# EAGLE design AdelinoR1 (EAGLE 9.2.1)
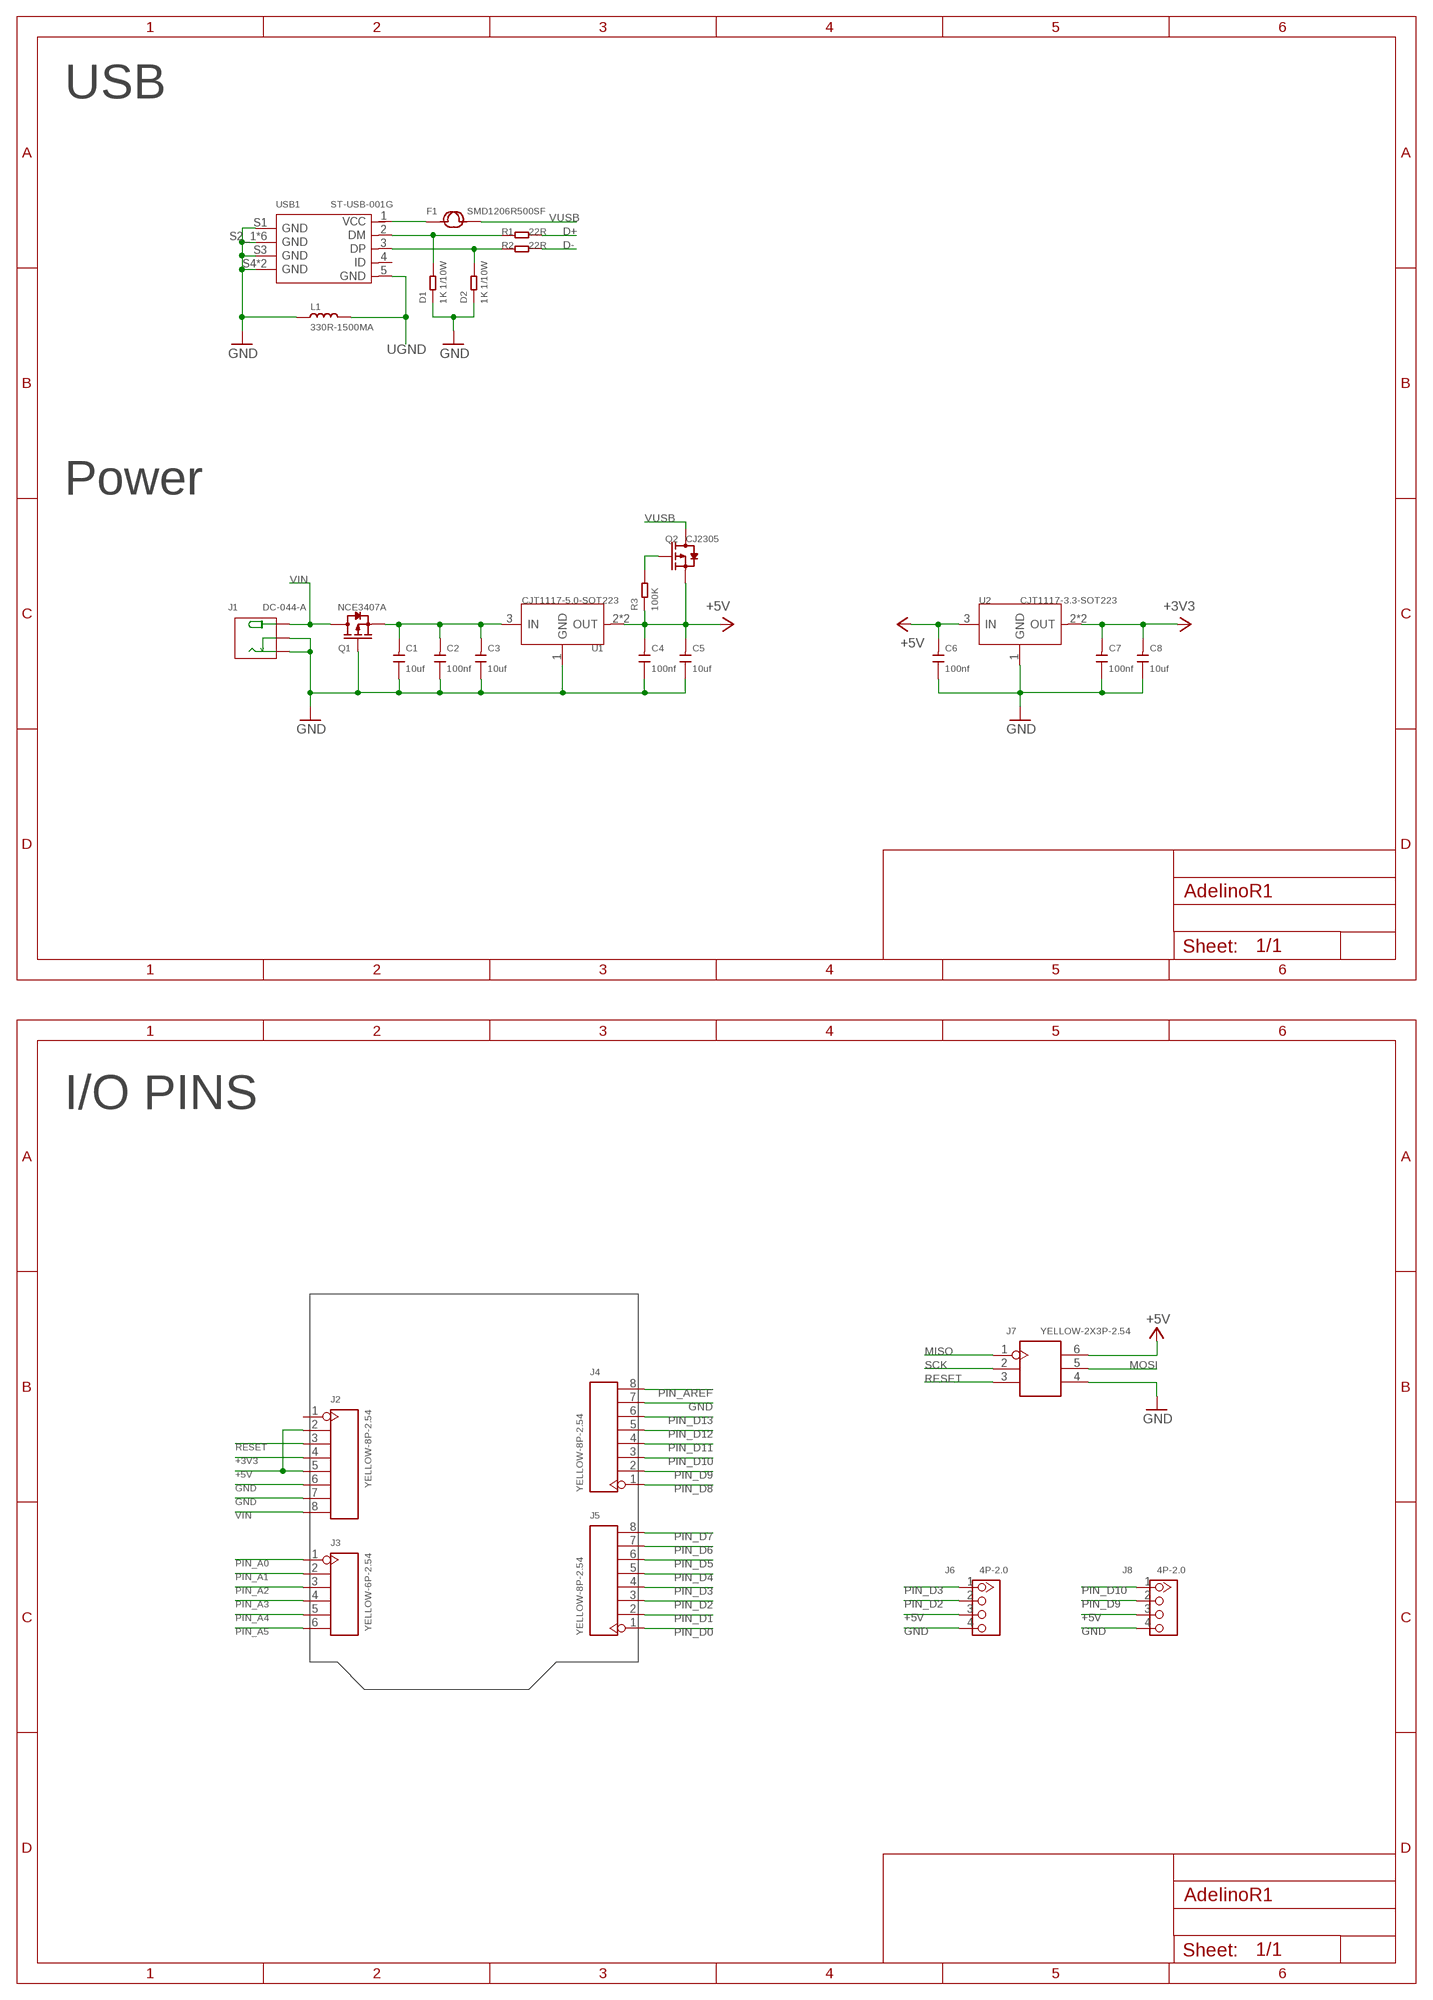
[diagram p0: schematic, sheet 1, part 1 of 2]
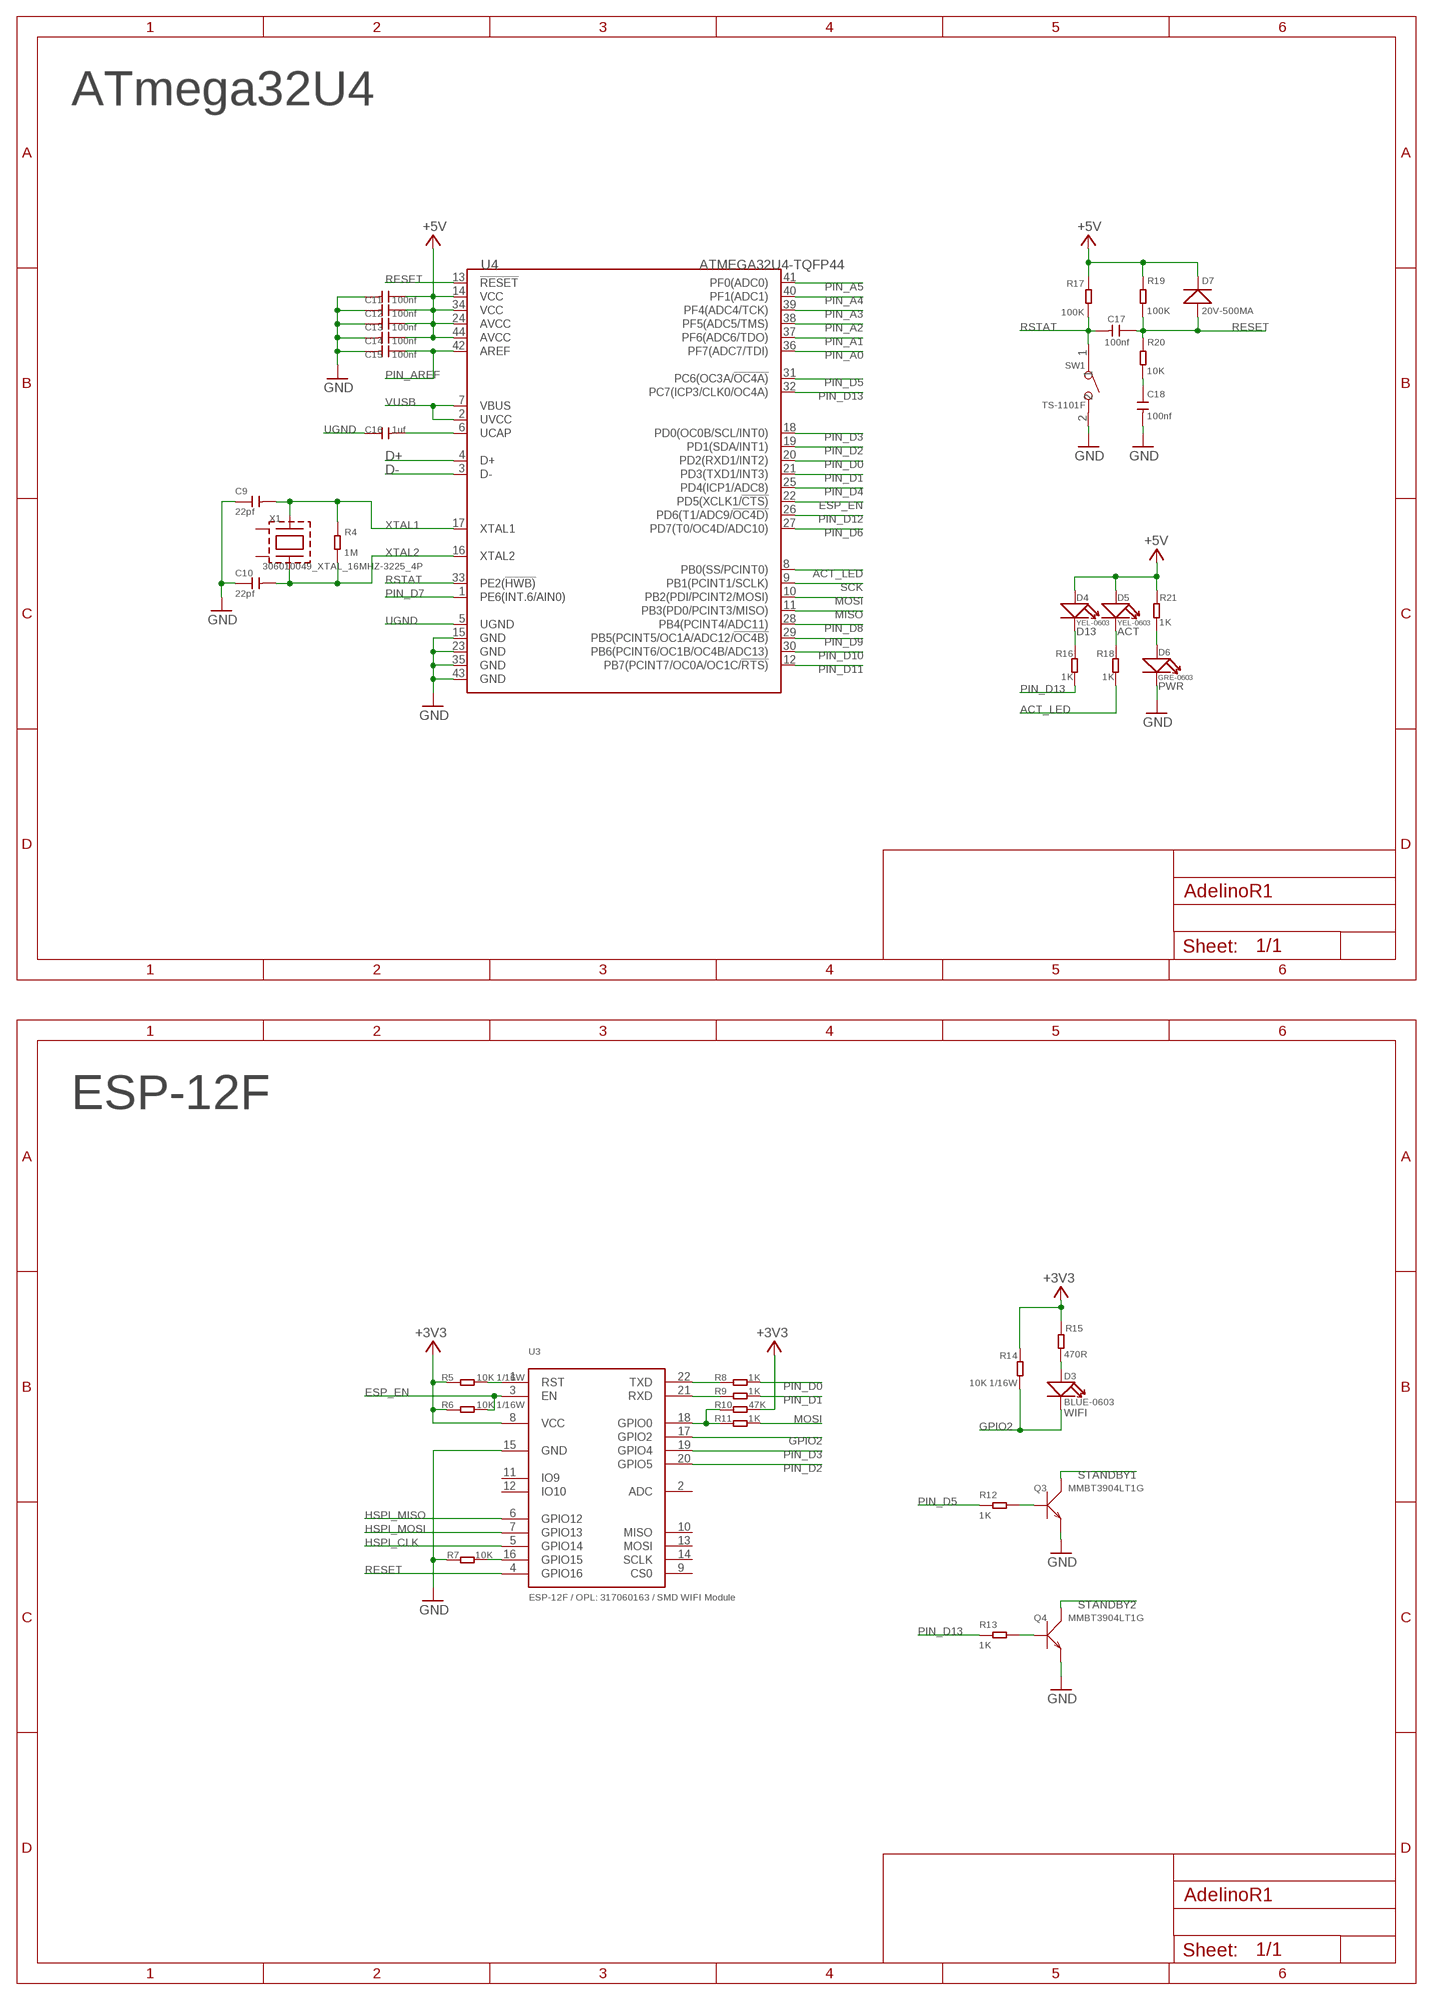
[diagram p1: schematic, sheet 1, part 2 of 2]

## Parts
C1  10uf  CERAMIC-10UF-25V-10%-X5R(0805)  [C0805]
C2  100nf  CERAMIC-100NF-25V-10%-X7R(0402)  [C0402]
C3  10uf  CERAMIC-10UF-25V-10%-X5R(0805)  [C0805]
C4  100nf  CERAMIC-100NF-25V-10%-X7R(0402)  [C0402]
C5  10uf  CERAMIC-10UF-25V-10%-X5R(0805)  [C0805]
C6  100nf  CERAMIC-100NF-25V-10%-X7R(0402)  [C0402]
C7  100nf  CERAMIC-100NF-25V-10%-X7R(0402)  [C0402]
C8  10uf  CERAMIC-10UF-25V-10%-X5R(0805)  [C0805]
C9  22pf  CERAMIC-22PF-50V-5%-NPO(0402)  [C0402]
C10  22pf  CERAMIC-22PF-50V-5%-NPO(0402)  [C0402]
C11  100nf  CERAMIC-100NF-25V-10%-X7R(0402)  [C0402]
C12  100nf  CERAMIC-100NF-25V-10%-X7R(0402)  [C0402]
C13  100nf  CERAMIC-100NF-25V-10%-X7R(0402)  [C0402]
C14  100nf  CERAMIC-100NF-25V-10%-X7R(0402)  [C0402]
C15  100nf  CERAMIC-100NF-25V-10%-X7R(0402)  [C0402]
C16  1uf  CERAMIC-1UF-25V-10%-X7R(0805)  [C0805]
C17  100nf  CERAMIC-100NF-25V-10%-X7R(0402)  [C0402]
C18  100nf  CERAMIC-100NF-25V-10%-X7R(0402)  [C0402]
D1  1K 1/10W  SMD-ESD-CG0603MLC-05E  [D0603]
D2  1K 1/10W  SMD-ESD-CG0603MLC-05E  [D0603]
D3  BLUE-0603  SMD-LED-CLEAR-BLUE(0603)  [LED-0603]
D4  YEL-0603  SMD-LED-CLEAR-YELLOW(0603)  [LED-0603]
D5  YEL-0603  SMD-LED-CLEAR-YELLOW(0603)  [LED-0603]
D6  GRE-0603  SMD-LED-CLEAR-GREEN(0603)  [LED-0603]
D7  20V-500MA  SMD-DIODE-SCHOTTKY-20V-500MA(SOD-123)P  [SOD-123]
F1  SMD1206R500SF  SMD-PPTC-500MA(1206)  [F1206]
J1  DC-044-A  JACK-DC-044-A  [DCJ3P-11.6X9.6X7.0MM]
J2  YELLOW-8P-2.54  DIP-YELLOW-FEMALE-HEADER(8P-2.54)  [H8-2.54]
J3  YELLOW-6P-2.54  DIP-YELLOW-FEMALE-HEADER-VERT(6P-2.54)  [H6-2.54]
J4  YELLOW-8P-2.54  DIP-YELLOW-FEMALE-HEADER(8P-2.54)  [H8-2.54]
J5  YELLOW-8P-2.54  DIP-YELLOW-FEMALE-HEADER(8P-2.54)  [H8-2.54]
J6  4P-2.0  GROVE-CONNECTOR-DIP(4P-2.0)  [HW4-2.0]
J7  YELLOW-2X3P-2.54  DIP-YELLOW-MALE-HEADER-VERT(2X3P-2.54)  [H2X3-2.54]
J8  4P-2.0  GROVE-CONNECTOR-DIP(4P-2.0)  [HW4-2.0]
L1  330R-1500MA  SMD-FERRITE-BEAD-330R-1500MA(0805)'0805'  [L0805]
Q1  NCE3407A  SMD-MOSFET-P-CH-VDC=30V-ID=4.3A-NCE3407A(SOT-23)  [SOT-23]
Q2  CJ2305  SMD-MOSFET-P-CH-8V-4.1A-CJ2305(SOT-23)  [SOT-23]
Q3  MMBT3904LT1G  SMD-TRANSISTORS-NPN-40V-200MA-MMBT3904LT1G(SOT-23)  [SOT-23]
Q4  MMBT3904LT1G  SMD-TRANSISTORS-NPN-40V-200MA-MMBT3904LT1G(SOT-23)  [SOT-23]
R1  22R  SMD-RES-22R-1%-1/16W(0402)  [R0402]
R2  22R  SMD-RES-22R-1%-1/16W(0402)  [R0402]
R3  100K  SMD-RES-100K-1%-1/16W(0402)  [R0402]
R4  1M  SMD-RES-1M-1%-1/16W(0402)  [R0402]
R5  10K 1/16W  SMD-RES-10K-1%-1/16W(0402)  [R0402]
R6  10K 1/16W  SMD-RES-10K-1%-1/16W(0402)  [R0402]
R7  10K  SMD-RES-10K-1%-1/16W(0402)  [R0402]
R8  1K  SMD-RES-1K-5%-1/16W(0402)  [R0402]
R9  1K  SMD-RES-1K-5%-1/16W(0402)  [R0402]
R10  47K  SMD-RES-47K-5%-1/16W(0402)  [R0402]
R11  1K  SMD-RES-1K-5%-1/16W(0402)  [R0402]
R12  1K  SMD-RES-1K-5%-1/16W(0402)  [R0402]
R13  1K  SMD-RES-1K-5%-1/16W(0402)  [R0402]
R14  10K 1/16W  SMD-RES-10K-1%-1/16W(0402)  [R0402]
R15  470R  SMD-RES-470R-5%-1/16W(0402)  [R0402]
R16  1K  SMD-RES-1K-5%-1/16W(0402)  [R0402]
R17  100K  SMD-RES-100K-1%-1/16W(0402)  [R0402]
R18  1K  SMD-RES-1K-5%-1/16W(0402)  [R0402]
R19  100K  SMD-RES-100K-1%-1/16W(0402)  [R0402]
R20  10K  SMD-RES-10K-1%-1/16W(0402)  [R0402]
R21  1K  SMD-RES-1K-5%-1/16W(0402)  [R0402]
SW1  TS-1101F  DIP-BUTTON(2P-6.0X3.0X4.3MM)-TS-1101F  [SW2-5.0-6.0X3.0X4.3MM]
U1  CJT1117-5.0-SOT223  PMIC-CJT1117-5.0(SOT223)  [SOT-223]
U2  CJT1117-3.3-SOT223  PMIC-CJT1117-3.3(SOT223)  [SOT-223]
U3  ESP-12F / OPL: 317060163 / SMD WIFI Module  ESP-12F  [ESP-12F]
U4  ATMEGA32U4-TQFP44  MCU-ATMEGA32U4-AU(TQFP44)  [TQFP44-0.8-9.6X9.6MM]
USB1  ST-USB-001G  MICRO-USB-SMD-B-WITHOUT-POST-W/P(ST-USB-001G)  [MICRO-USB5+4P-SMD-0.65-B]
X1  306010049_XTAL_16MHZ-3225_4P  [X3225_4P]

## Nets
+3V3: C7.2 C8.2 J2.4 R5.1 R6.1 R10.2 R14.2 R15.2 U2.2(OUT) U2.TER(OUT) U3.8(VCC)
+5V: C4.2 C5.2 C6.2 C11.1 C12.1 C13.1 C14.1 D4.+ D5.+ D7.- J2.2 J2.5 J6.3 J7.6 J8.3 Q2.2(S) R3.1 R17.1 R19.2 R21.1 U1.2(OUT) U1.TER(OUT) U2.3(IN) U4.14(VCC) U4.24(AVCC) U4.34(VCC) U4.44(AVCC)
ACT_LED: R18.2 U4.8(PB0(SS/PCINT0))
D+: R1.2 U4.4(D+)
D-: R2.2 U4.3(D-)
ESP_EN: R6.2 U3.3(EN) U4.22(PD5(XCLK1/!CTS))
GND: C1.1 C2.1 C3.1 C4.1 C5.1 C6.1 C7.1 C8.1 C9.1 C10.1 C11.2 C12.2 C13.2 C14.2 C15.2 C18.2 D1.1 D2.1 D6.- J1.CDN1(CDN) J1.CDN2(CDN) J1.CDN3(CDN) J1.CDN4(CDN) J1.GND1(-) J1.GND2(-) J1.GND3(-) J1.GND4(-) J2.6 J2.7 J4.7 J6.4 J7.4 J8.4 L1.1 Q1.1(G) Q3.2(E) Q4.2(E) R7.1 SW1.2 U1.1(GND) U2.1(GND) U3.15(GND) U4.15(GND) U4.23(GND) U4.35(GND) U4.43(GND) USB1.S1(GND) USB1.S2_1(GND) USB1.S2_2(GND) USB1.S2_3(GND) USB1.S3(GND) USB1.S4(GND) USB1.S5_1(GND) USB1.S5_2(GND) USB1.S5_3(GND) USB1.S6(GND)
GPIO0: R10.1 R11.1 U3.18(GPIO0)
GPIO2: D3.- R14.1 U3.17(GPIO2)
HSPI_CLK: U3.5(GPIO14)
HSPI_MISO: U3.6(GPIO12)
HSPI_MOSI: U3.7(GPIO13)
MISO: J7.1 U4.11(PB3(PD0/PCINT3/MISO))
MOSI: J7.5 R11.2 U4.10(PB2(PDI/PCINT2/MOSI))
N$1: D1.2 R1.1 USB1.2(DM)
N$2: D2.2 R2.1 USB1.3(DP)
N$3: Q2.1(G) R3.2
N$4: R7.2 U3.16(GPIO15)
N$5: D6.+ R21.2
N$6: D5.- R18.1
N$7: C16.2 U4.6(UCAP)
N$8: D4.- R16.1
N$9: F1.1 USB1.1(VCC)
N$10: C1.2 C2.2 C3.2 Q1.2(S) U1.3(IN)
N$12: D3.+ R15.1
N$13: C18.1 R20.2
N$14: R5.2 U3.1(RST)
N$16: Q3.1(B) R12.2
N$17: R8.1 U3.22(TXD)
N$18: R9.1 U3.21(RXD)
N$21: Q4.1(B) R13.2
PIN_A0: J3.1 U4.36(PF7(ADC7/TDI))
PIN_A1: J3.2 U4.37(PF6(ADC6/TDO))
PIN_A2: J3.3 U4.38(PF5(ADC5/TMS))
PIN_A3: J3.4 U4.39(PF4(ADC4/TCK))
PIN_A4: J3.5 U4.40(PF1(ADC1))
PIN_A5: J3.6 U4.41(PF0(ADC0))
PIN_AREF: C15.1 J4.8 U4.42(AREF)
PIN_D0: J5.1 R8.2 U4.20(PD2(RXD1/INT2))
PIN_D1: J5.2 R9.2 U4.21(PD3(TXD1/INT3))
PIN_D2: J5.3 J6.2 U3.20(GPIO5) U4.19(PD1(SDA/INT1))
PIN_D3: J5.4 J6.1 U3.19(GPIO4) U4.18(PD0(OC0B/SCL/INT0))
PIN_D4: J5.5 U4.25(PD4(ICP1/ADC8))
PIN_D5: J5.6 R12.1 U4.31(PC6(OC3A/!OC4A))
PIN_D6: J5.7 U4.27(PD7(T0/OC4D/ADC10))
PIN_D7: J5.8 U4.1(PE6(INT.6/AIN0))
PIN_D8: J4.1 U4.28(PB4(PCINT4/ADC11))
PIN_D9: J4.2 J8.2 U4.29(PB5(PCINT5/OC1A/ADC12/!OC4B))
PIN_D10: J4.3 J8.1 U4.30(PB6(PCINT6/OC1B/OC4B/ADC13))
PIN_D11: J4.4 U4.12(PB7(PCINT7/OC0A/OC1C/!RTS))
PIN_D12: J4.5 U4.26(PD6(T1/ADC9/!OC4D))
PIN_D13: J4.6 R13.1 R16.2 U4.32(PC7(ICP3/CLK0/OC4A))
RESET: C17.1 D7.+ J2.3 J7.3 R19.1 R20.1 U3.4(GPIO16) U4.13(!RESET)
RSTAT: C17.2 R17.2 SW1.1 U4.33(PE2(!HWB))
SCK: J7.2 U4.9(PB1(PCINT1/SCLK))
STANDBY1: Q3.3(C)
STANDBY2: Q4.3(C)
UGND: C16.1 L1.2 U4.5(UGND) USB1.5(GND)
VIN: J1.VCC1(+) J1.VCC2(+) J1.VCC3(+) J1.VCC4(+) J2.8 Q1.3(D)
VUSB: F1.2 Q2.3(D) U4.2(UVCC) U4.7(VBUS)
XTAL1: C9.2 R4.2 U4.17(XTAL1) X1.P$1
XTAL2: C10.2 R4.1 U4.16(XTAL2) X1.P$3
Unconnected: J2.1 U3.2(ADC) U3.9(CS0) U3.10(MISO) U3.11(IO9) U3.12(IO10) U3.13(MOSI) U3.14(SCLK) USB1.4(ID)

## Notes on the sheet
- USB | ATmega32U4
- Power
- I/O PINS | ESP-12F

## Power pins joined to a net without a drawn wire
GND1: X1.P$2(GND1)
GND2: X1.P$4(GND2)

## Library data of the parts
C1 C3 C5 C8 = Seeed-Capacitor:CERAMIC-10UF-25V-10%-X5R(0805): 302010178; MPN: CC0805KKX5R8BB106
C2 C4 C6 C7 C11-C15 C17 C18 = Seeed-Capacitor:CERAMIC-100NF-25V-10%-X7R(0402): 302010024; MPN: CC0402KRX7R8BB104
C9 C10 = Seeed-Capacitor:CERAMIC-22PF-50V-5%-NPO(0402): 302010018; MPN: CC0402JRNPO9BN220
C16 = Seeed-Capacitor:CERAMIC-1UF-25V-10%-X7R(0805): 302010179; MPN: CC0805KKX7R8BB105
D1 D2 = Seeed-Fuse:SMD-ESD-CG0603MLC-05E: 314130003; MPN: RC0603JR-071KL
D3 = Seeed-LED:SMD-LED-CLEAR-BLUE(0603): 304090045; LABEL: WIFI; MPN: 19-217-BHC-ZL1M2RY-3T
D4 = Seeed-LED:SMD-LED-CLEAR-YELLOW(0603): 304090044; LABEL: D13; MPN: 19-217-Y5C-AM1N1VY-3T; VALUE: YELLOW-0603
D5 = Seeed-LED:SMD-LED-CLEAR-YELLOW(0603): 304090044; LABEL: ACT; MPN: 19-217-Y5C-AM1N1VY-3T; VALUE: YELLOW-0603
D6 = Seeed-LED:SMD-LED-CLEAR-GREEN(0603): 304090043; LABEL: PWR; MPN: 19-217-G7C-AN1P2-3T; VALUE: GREEN-0603
D7 = Seeed-Diode:SMD-DIODE-SCHOTTKY-20V-500MA(SOD-123)P: 304020028; MPN: MBR0520LT1G
F1 = Seeed-Fuse:SMD-PPTC-500MA(1206): 307010002; MPN: SMD1206R500SF
J1 = Seeed-Connector:JACK-DC-044-A: 320120002; MPN: JACK-DC-044-A
J2 J4 J5 = Seeed-Connector:DIP-YELLOW-FEMALE-HEADER(8P-2.54): 320030065; MPN: F185-1108A1BSYC1
J3 = Seeed-Connector:DIP-YELLOW-FEMALE-HEADER-VERT(6P-2.54): 320030019; MPN: F185-1106A1BSYA3
J6 J8 = Seeed-Connector:GROVE-CONNECTOR-DIP(4P-2.0): 320110033
J7 = Seeed-Connector:DIP-YELLOW-MALE-HEADER-VERT(2X3P-2.54): 320020027; MPN: P125-1203A0BS116A2
L1 = Seeed-Inductor:SMD-FERRITE-BEAD-330R-1500MA(0805): 303030006; MPN: BLM21PG331SN1D
Q1 = Seeed-Transistor:SMD-MOSFET-P-CH-VDC=30V-ID=4.3A-NCE3407A(SOT-23): 305030010; MPN: NCE3407A
Q2 = Seeed-Transistor:SMD-MOSFET-P-CH-8V-4.1A-CJ2305(SOT-23): 305030014; MPN: CJ2305
Q3 Q4 = Seeed-Transistor:SMD-TRANSISTORS-NPN-40V-200MA-MMBT3904LT1G(SOT-23): 305010013; MPN: MMBT3904LT1G
R1 R2 = Seeed-Resistor:SMD-RES-22R-1%-1/16W(0402): 301010052; MPN: RC0402FR-0722RL
R3 R17 R19 = Seeed-Resistor:SMD-RES-100K-1%-1/16W(0402): 301010456; MPN: RC0402FR-07100KL
R4 = Seeed-Resistor:SMD-RES-1M-1%-1/16W(0402): 301010043; MPN: RC0402FR-071ML
R5 R6 R14 = Seeed-Resistor:SMD-RES-10K-1%-1/16W(0402): 301010047; MPN: RC0402FR-0710KL
R7 R20 = Seeed-Resistor:SMD-RES-10K-1%-1/16W(0402): 301010047; MPN: RC0402FR-0710KL; VALUE: 10K 1/16W
R8 R9 R11-R13 R16 R18 R21 = Seeed-Resistor:SMD-RES-1K-5%-1/16W(0402): 301010006; MPN: RC0402JR-071KL
R10 = Seeed-Resistor:SMD-RES-47K-5%-1/16W(0402): 301010005; MPN: RC0402JR-0747KL
R15 = Seeed-Resistor:SMD-RES-470R-5%-1/16W(0402): 301010013; MPN: RC0402JR-07470RL; VALUE: 470R 1/16W
SW1 = Seeed-Switch:DIP-BUTTON(2P-6.0X3.0X4.3MM): 311020025; MPN: TS-1101F
U1 = Seeed-IC:PMIC-CJT1117-5.0(SOT223): 310030096; MPN: CJT1117-5.0
U2 = Seeed-IC:PMIC-CJT1117-3.3(SOT223): 310030097; MPN: CJT1117-3.3
U3 = Seeed-OPL-2017-01-Sensor-camilo:ESP-12F: 317060163
U4 = Seeed-IC:MCU-ATMEGA32U4-AU(TQFP44): 310010010; MPN: ATMEGA32U4
USB1 = Seeed-Connector:MICRO-USB-SMD-B-WITHOUT-POST-W/P(ST-USB-001G): 320010000; MPN: ST-USB-001G
X1 = Seeed-OPL-2017-01-Crystal-Akita:306010049_XTAL_16MHZ-3225_4P: SMD Crystal 16MHz-9pF-10ppm-40R;4P-L3.2*W2.5mm, SKU: 306010049

## Net classes
0 default: width 0.254 mm, drill 0.61 mm, clearance 0.254 mm

## Board
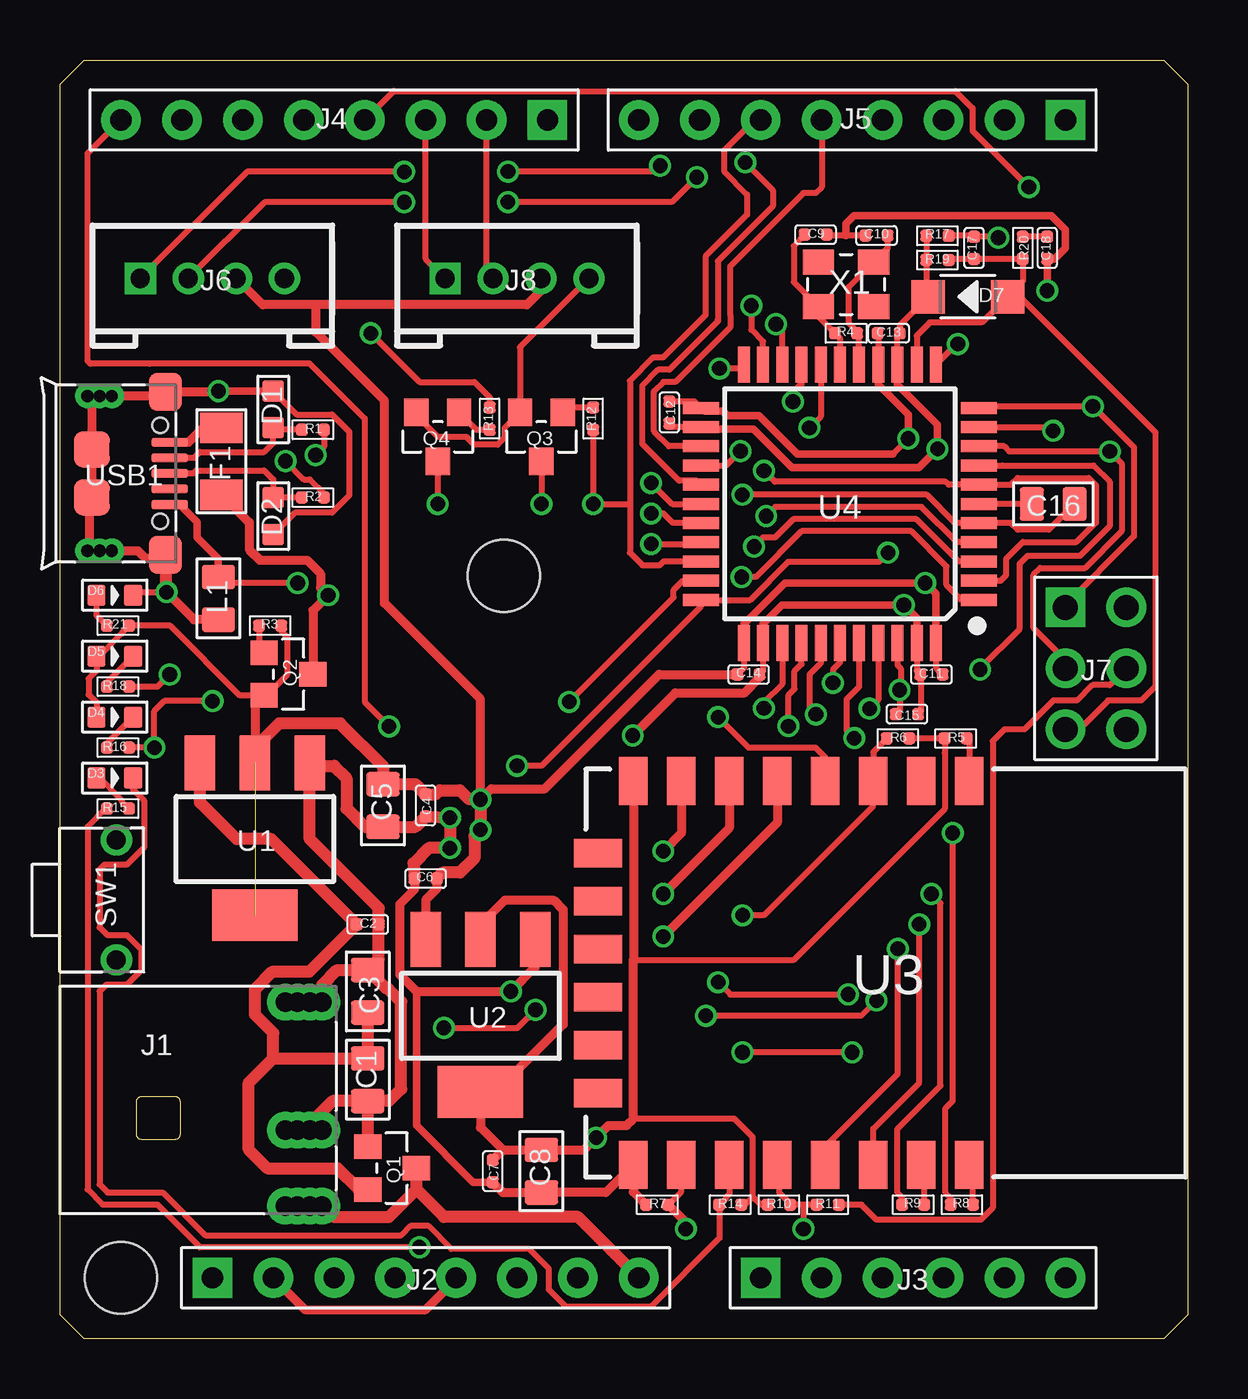
[diagram p2: board, top side]
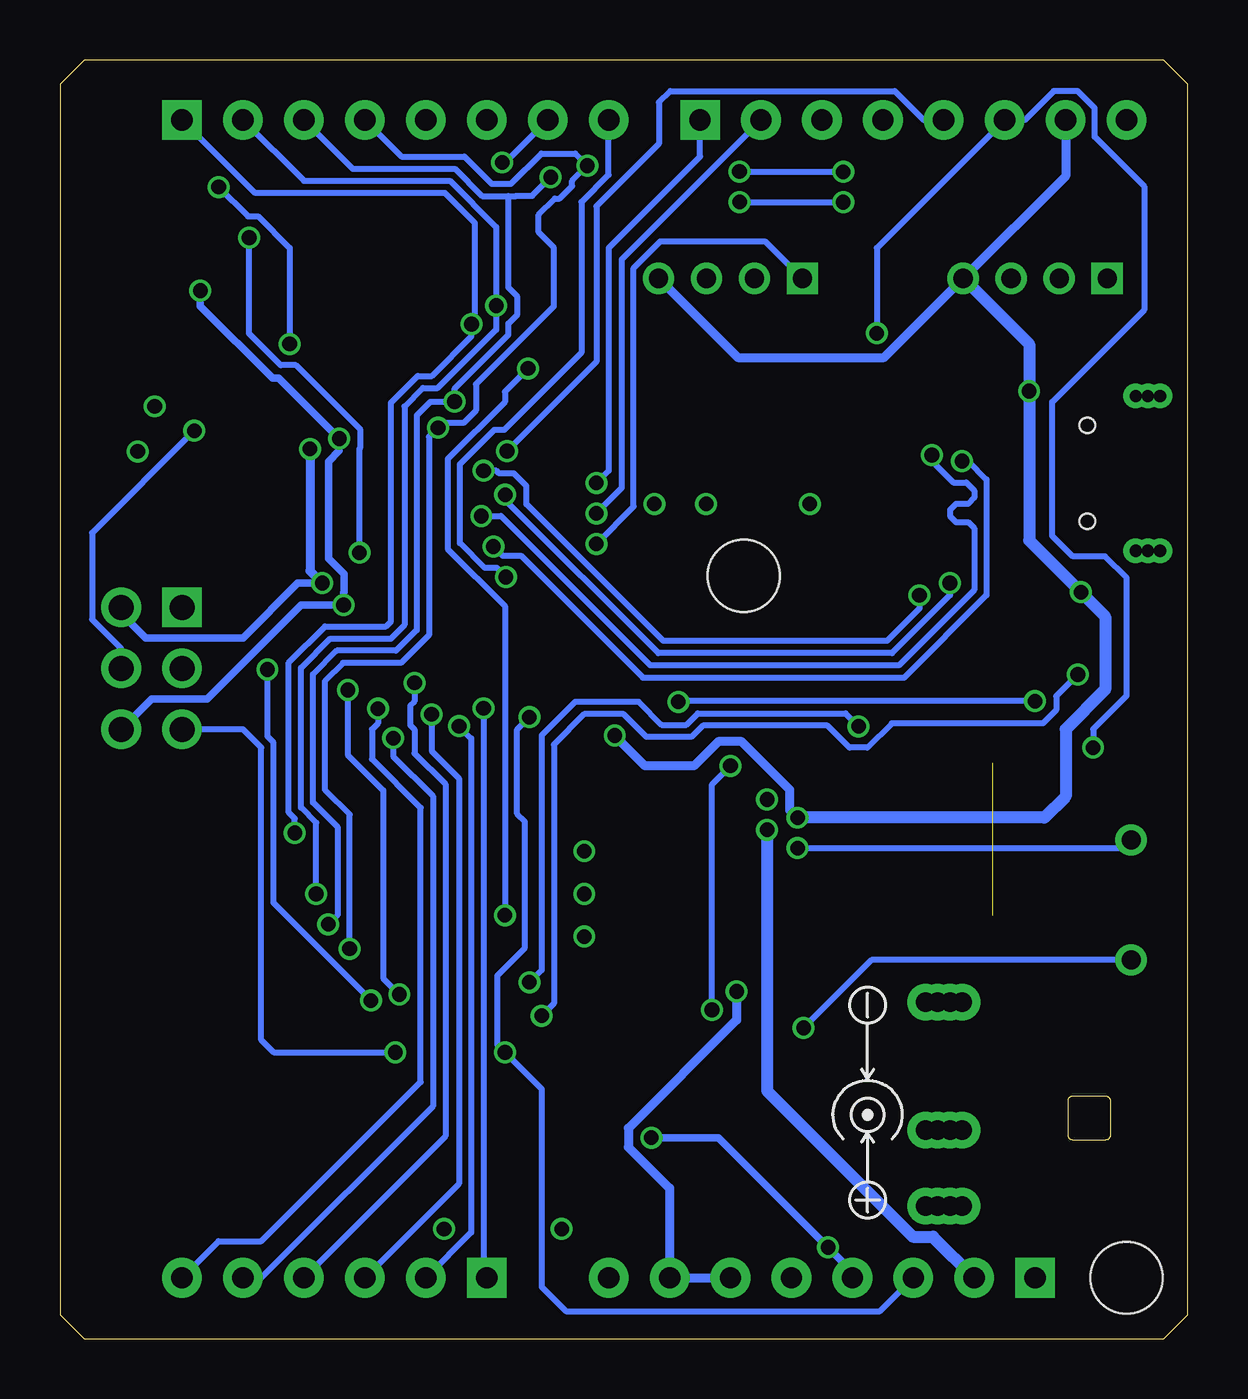
[diagram p3: board, bottom side, seen from below]

Size 47 x 53.3 mm. Coordinates in mm from the lower left corner, seen from the top.
Outline: 0,1 0,52.3 1,53.3 46,53.3 47,52.3 47,1 46,0 1,0 0,1
Copper layers (1*16): Top 0.035mm / dielectric 1.5mm / Bottom 0.035mm
Design rules "default *": minimum track width 6mil, minimum drill 12mil, track to track 6mil, track to pad 6mil, pad to pad 6mil, via to via 6mil, smd to smd 0mil, copper to edge 10mil, drill to drill 10mil, minimum pad ring 10mil, minimum via ring 6mil, stop-mask expansion 2mil, vias tented up to drill 100mil, thermal gap 10mil
Holes 3 mm at 18.5,31.8 2.54,2.54
tKeepout: area 16.5,29.8 to 20.5,33.8; area 0.5,0.5 to 4.5,4.5
bKeepout: area 16.5,29.8 to 20.5,33.8; area 0.5,0.5 to 4.5,4.5
tRestrict: area 16.5,29.8 to 20.5,33.8; area 0.5,0.5 to 4.5,4.5; area 39.1,6.1 to 47,24.4
bRestrict: area 16.5,29.8 to 20.5,33.8; area 0.5,0.5 to 4.5,4.5; area 38.9,6.1 to 47,24.4

### Footprints (pad centres in the part's own frame; a part is rotated, then mirrored left to right if it is on the bottom)
C0805 = smd 1.397 x 1.016: 1 0,0.889; 2 0,-0.889
C0402 = smd 0.5 x 0.5: 1 0,0.463; 2 0,-0.463
D0603 = smd 0.889 x 0.889: 1 0,0.762; 2 0,-0.762
LED-0603 = smd 0.762 x 0.889: + -0.762,0; - 0.762,0
SOD-123 = smd 1.397 x 1.397: + -1.651,0; - 1.651,0
F1206 = smd 1.27 x 1.778: 1 -1.397,0; 2 1.397,0
DCJ3P-11.6X9.6X7.0MM = drill 0.813 pad 1.524: CDN1 1.206,10.922; CDN2 1.206,10.414; CDN3 1.206,9.906; CDN4 1.206,9.398; GND1 -4.128,10.922; GND2 -4.128,10.414; GND3 -4.128,9.906; GND4 -4.128,9.398; VCC1 4.381,10.922; VCC2 4.381,10.414; VCC3 4.381,9.906; VCC4 4.381,9.398
H8-2.54 = drill 0.889 pad 1.651 square: 1 0,8.89 | drill 0.889 pad 1.651: 2 0,6.35; 3 0,3.81; 4 0,1.27; 5 0,-1.27; 6 0,-3.81; 7 0,-6.35; 8 0,-8.89
H6-2.54 = drill 0.889 pad 1.651 square: 1 0,6.35 | drill 0.889 pad 1.651: 2 0,3.81; 3 0,1.27; 4 0,-1.27; 5 0,-3.81; 6 0,-6.35
HW4-2.0 = drill 0.8 pad 1.27 square: 1 -3,0 | drill 0.8 pad 1.27: 2 -1,0; 3 1,0; 4 3,0
H2X3-2.54 = drill 1.041 pad 1.651 square: 1 -1.27,2.54 | drill 1.041 pad 1.651: 2 -1.27,0; 3 -1.27,-2.54; 4 1.27,-2.54; 5 1.27,0; 6 1.27,2.54
L0805 = smd 1.016 x 1.397: 1 -0.889,0; 2 0.889,0
SOT-23 = smd 1.016 x 1.143: 1 -0.889,-1.016; 2 0.889,-1.016; 3 0,1.016
R0402 = smd 0.5 x 0.5: 1 0,0.463; 2 0,-0.463
SW2-5.0-6.0X3.0X4.3MM = drill 0.8 pad 1.27: 1 -2.5,0; 2 2.5,0
SOT-223 = smd 1.27 x 2.286: 1 -2.286,-3.175; 2 0,-3.175; 3 2.286,-3.175 | smd 3.556 x 2.159: TER 0,3.175
ESP-12F = smd 2 x 1.2: 1 -8,3.48; 2 -8,1.48; 3 -8,-0.52; 4 -8,-2.52; 5 -8,-4.52; 6 -8,-6.52; 7 -8,-8.52; 8 -8,-10.52; 15 8,-10.52; 16 8,-8.52; 17 8,-6.52; 18 8,-4.52; 19 8,-2.52; 20 8,-0.52; 21 8,1.48; 22 8,3.48 | smd 1.2 x 2: 9 -5,-12; 10 -3,-12; 11 -1,-12; 12 1,-12; 13 3,-12; 14 5,-12
TQFP44-0.8-9.6X9.6MM = smd 1.5 x 0.5: 1 -5.8,4; 2 -5.8,3.2; 3 -5.8,2.4; 4 -5.8,1.6; 5 -5.8,0.8; 6 -5.8,0; 7 -5.8,-0.8; 8 -5.8,-1.6; 9 -5.8,-2.4; 10 -5.8,-3.2; 11 -5.8,-4; 23 5.8,-4; 24 5.8,-3.2; 25 5.8,-2.4; 26 5.8,-1.6; 27 5.8,-0.8; 28 5.8,0; 29 5.8,0.8; 30 5.8,1.6; 31 5.8,2.4; 32 5.8,3.2; 33 5.8,4 | smd 0.5 x 1.5: 12 -4,-5.8; 13 -3.2,-5.8; 14 -2.4,-5.8; 15 -1.6,-5.8; 16 -0.8,-5.8; 17 0,-5.8; 18 0.8,-5.8; 19 1.6,-5.8; 20 2.4,-5.8; 21 3.2,-5.8; 22 4,-5.8; 34 4,5.8; 35 3.2,5.8; 36 2.4,5.8; 37 1.6,5.8; 38 0.8,5.8; 39 0,5.8; 40 -0.8,5.8; 41 -1.6,5.8; 42 -2.4,5.8; 43 -3.2,5.8; 44 -4,5.8
MICRO-USB5+4P-SMD-0.65-B = smd 0.381 x 1.524: 1 -1.3,-0.25; 2 -0.65,-0.25; 3 0,-0.25; 4 0.65,-0.25; 5 1.3,-0.25 | smd 1.6 x 1.397: S1 -3.4,-0.427; S6 3.4,-0.427 | drill 0.508 pad 1.016: S2_1 -3.226,-3.683; S2_2 -3.226,-3.175; S2_3 -3.226,-2.667; S5_1 3.226,-3.683; S5_2 3.226,-3.175; S5_3 3.226,-2.667 | smd 1.5 x 1.5: S3 -1,-3.5; S4 1,-3.5 | hole 0.635: -2,-0.65; 2,-0.65
X3225_4P = smd 1.3 x 1.05: P$1 -1.15,-0.925; P$2 1.15,-0.925; P$3 1.15,0.925; P$4 -1.15,0.925

### Placement (x,y rotation side)
C1  12.83,10.79 180 top
C2  12.83,17.27 270 top
C3  12.83,14.48 0 top
C4  15.24,22.23 180 top
C5  13.46,22.23 180 top
C6  15.24,19.18 90 top
C7  18.03,6.99 180 top
C8  20.07,6.99 180 top
C9  31.5,46.02 270 top
C10  34.04,45.98 90 top
C11  36.32,27.69 270 top
C12  25.4,38.61 180 top
C13  34.54,41.91 270 top
C14  28.7,27.69 90 top
C15  35.31,26.04 90 top
C16  41.4,34.8 270 top
C17  38.1,45.47 180 top
C18  41.15,45.47 0 top
D1  8.89,38.73 0 top
D2  8.89,34.29 180 top
D3  2.29,23.37 0 top
D4  2.29,25.91 0 top
D5  2.29,28.45 0 top
D6  2.29,30.99 0 top
D7  37.85,43.43 180 top
F1  6.73,36.58 270 top
J1  0,9.91 270 top
J2  15.24,2.54 90 top
J3  35.56,2.54 90 top
J4  11.43,50.8 270 top
J5  33.02,50.8 270 top
J6  6.35,44.2 0 top
J7  43.18,27.94 0 top
J8  19.05,44.2 0 top
L1  6.6,30.86 90 top
Q1  13.84,7.11 270 top
Q2  9.53,27.7 270 top
Q3  20.07,37.59 180 top
Q4  15.75,37.59 180 top
R1  10.54,37.89 90 top
R2  10.54,35.06 90 top
R3  8.76,29.72 270 top
R4  32.77,41.91 270 top
R5  37.34,25.02 90 top
R6  34.92,25.02 270 top
R7  24.89,5.59 90 top
R8  37.59,5.59 270 top
R9  35.56,5.59 270 top
R10  29.97,5.59 270 top
R11  32,5.59 90 top
R12  22.23,38.35 180 top
R13  17.91,38.35 0 top
R14  27.94,5.59 90 top
R15  2.41,22.1 270 top
R16  2.41,24.64 90 top
R17  36.58,45.97 90 top
R18  2.41,27.18 90 top
R19  36.58,44.96 270 top
R20  40.13,45.47 180 top
R21  2.41,29.72 270 top
SW1  2.35,18.29 90 top
U1  8.13,20.83 180 top
U2  17.53,13.46 180 top
U3  34.42,15.24 270 top
U4  32.51,34.8 180 top
USB1  4.83,36.07 270 top
X1  32.77,43.94 0 top

### Tracks (layer width: path | path; a pad name or v marks a point on that pad's centre or on a via)
+3V3  (via drill 0.61)
  Top 0.254: 28.88,5.92 28.88,8.4 28.11,9.16 23.9,9.16 | v14.99,3.81 5.84,3.81 4.06,5.59 1.78,5.59 1.15,6.22 1.15,21.34 1.91,22.1 R15.2 | 23.9,15.78 30.57,15.78 36.88,22.08 36.88,24.4 R5.1 R6.1 | R14.2 28.55,5.59 28.88,5.92 | R10.2 29.21,5.59 28.88,5.92
  Top 0.381: C7.2 18.46,7.87 | 18.46,7.87 C8.2 21.84,7.87 v22.35,8.38 22.86,8.89 23.62,8.89 23.9,9.16 23.9,15.78 U3.8 | 18.46,7.87 17.53,8.81 U2.TER 18.16,10.29 20.97,13.1 20.97,17.88 20.57,18.29 18.54,18.29 17.53,17.27 U2.2
  Bottom 0.305: v22.35,8.38 19.56,8.38 v14.99,3.81 13.97,2.79 J2.4
+5V  (via drill 0.61)  (1 unrouted)
  Top 0.254: C11.1 36.51,27.96 U4.44 | C14.1 28.51,27.96 U4.34 | C12.1 25.55,38 U4.24 | R17.1 R19.2 36.11,43.52 D7.- 35.01,42.24 C13.1 34.91,41.82 U4.14 | R3.1 9.23,29.49 9.46,29.26 9.46,27.67 8.6,26.81 Q2.2 7.49,26.81 4.59,29.72 R21.1 2.58,29.42 2.58,29.38 1.69,28.49 1.52,28.49 D5.+ 1.52,27.84 1.19,27.51 1.19,26.84 1.52,26.51 D4.+
  Top 0.305: 8.4,24 U1.2 | U4.34 28.51,29.78 30.23,31.5 v36.07,31.5 36.51,31.05 U4.44 | 26.74,37.97 U4.24 26.8,37.91 28.91,37.91 30.51,36.31 35.8,36.31 v36.58,37.08 36.58,38.1 34.91,39.76 U4.14
  Top 0.381: C6.2 15.7,18.75 15.24,18.29 U2.3 | Q2.2 8.13,26.43 U1.2 | J2.2 10.22,1.21 15.24,1.21 16.51,2.48 J2.5 | J6.3 8.45,43.1 10.67,43.1 | J8.3 20.05,43.69 19.46,43.1 10.67,43.1 | C14.1 24.97,27.69 20.21,22.92 17.97,22.92 v17.53,22.48 17.53,26.66 13.53,30.66 13.53,39.1 10.67,41.96 10.67,43.1
  Top 0.508: U1.2 8.13,24.64 9.14,25.65 11.68,25.65 13.46,23.88 C5.2 14.81,23.11 C4.2 15.66,22.69 15.84,22.86 16.68,22.86 17.06,22.48 v17.53,22.48 v17.53,21.21 17.27,20.95 17.27,20.03 16.68,19.43 15.96,19.43 C6.2
  Bottom 0.305: v36.07,31.5 37.08,31.5 39.37,29.21 43.43,29.21 44.45,30.23 J7.6
  Bottom 0.381: v36.58,37.08 36.58,32 v36.07,31.5
  Bottom 0.508: v17.53,21.21 17.53,10.33 11.45,4.25 10.6,4.25 J2.2
ACT_LED  (via drill 0.61)
  Top 0.254: R18.2 4.06,27.18 v4.57,27.69 | v34.04,14.1 33.4,13.46 v26.92,13.46 | v38.35,27.89 38.35,27.94 40.01,29.59 40.01,32.3 40.34,32.64 42.52,32.64 43.75,33.87 43.75,35.73 43.08,36.4 39.29,36.4 U4.8
  Bottom 0.254: v4.57,27.69 5.47,26.79 5.47,26.21 6.02,25.65 12.33,25.65 13.35,24.64 14.08,24.64 15,25.56 20.21,25.56 20.68,25.08 22.55,25.08 23.51,26.04 25.15,26.04 26.42,24.77 26.42,13.97 v26.92,13.46 | v38.35,27.89 38.35,25.1 38.1,24.85 38.1,18.17 v34.04,14.11 v34.04,14.1
D+  (via drill 0.61)
  Top 0.254: v29.44,34.29 29.82,34.67 35.92,34.67 37.39,33.2 U4.4 | R1.2 11,37.18 v10.65,36.83
  Bottom 0.254: v29.44,34.29 28.62,34.29 22.4,28.07 12.04,28.07 8.89,31.22 8.89,33.78 9.14,34.04 9.65,34.04 9.91,34.29 9.91,34.54 9.65,34.8 9.14,34.8 8.89,35.05 8.89,35.35 9.23,35.69 9.77,35.69 10.67,36.59 10.67,36.82 v10.65,36.83
D-  (via drill 0.61)
  Top 0.254: v28.93,33.02 29.31,33.4 29.81,33.4 30.57,34.16 35.7,34.16 37.47,32.4 U4.3 | v9.4,36.58 10.16,35.81 10.41,35.81 11,35.22 R2.2
  Bottom 0.254: v9.4,36.58 9.14,36.58 8.38,35.82 8.38,30.99 11.81,27.56 22.71,27.56 27.79,32.64 28.55,32.64 v28.93,33.02
ESP_EN  (via drill 0.61)
  Top 0.254: U4.22 28.36,40.44 v27.49,40.44 | v28.46,17.65 29.34,17.65 33.9,22.21 U3.3 33.9,24.45 R6.2
  Bottom 0.254: v27.49,40.44 28.46,39.47 28.46,39.04 30.84,36.66 30.84,32.92 28.46,30.54 v28.46,17.65
GND  (via drill 0.61)
  Top 0.254: C14.2 29.31,27.83 U4.35 | C12.2 26.44,39.07 U4.23 | C13.2 34.11,41.88 U4.15 | C9.1 31.99,45.98 32.77,45.98 C10.1 | D1.1 9.86,38.52 11.34,38.52 12.05,37.81 12.05,35.15 11.34,34.43 9.79,34.43 D2.1 | C15.2 35.89,26.16 35.89,27.41 35.86,27.44 C11.2 35.71,27.83 U4.43 | D6.- 3.17,31.11 v4.45,31.11 | v35.36,37.52 34.71,36.87 | J8.4 19.18,41.32 Q3.2 18.54,37.97 18.54,37.56 18.24,37.26 17.27,37.26 16.93,37.59 15.75,37.59 14.86,38.48 Q4.2
  Top 0.305: v6.6,39.5 D1.1 | 14.86,14.48 14.86,8.89 17.23,6.52 C7.1 | U4.35 29.31,29.79 30.1,30.58 v35.18,30.58 35.71,30.05 U4.43 | U4.23 26.86,38.65 27.63,38.65 27.81,38.47 29.14,38.47 30.74,36.87 34.71,36.87 | U4.15 34.11,39.77 35.36,38.53 v35.36,37.52 | v41.15,43.69 C18.2 41.45,45 41.91,45.47 41.91,46.23 41.33,46.81 33.09,46.81 32.77,46.48 32.77,45.98
  Top 0.381: C7.1 18.46,6.1 C8.1 22.75,6.1 U3.15 23.9,6.12 R7.1 | C6.1 14.78,18.72 14.16,18.11 14.16,15.18 14.86,14.48 v18.8,14.48 19.81,15.49 U2.1 | L1.1 5.59,29.97 v4.45,31.11 | 1.21,32.84 USB1.S5_2 USB1.S5_3 3.25,32.84 3.54,32.54 4.4,32.54 | 1.21,32.84 1.21,34.95 USB1.S4 USB1.S3 1.33,39.11 USB1.S2_1 USB1.S2_2 USB1.S2_3 4.22,39.29 USB1.S1 6.58,39.47 v6.6,39.5 | USB1.S5_1 1.21,32.84 | v23.88,25.15 25.65,26.92 28.53,26.92 29.16,27.56 C14.2
  Top 0.508: C3.1 11.56,15.37 10.92,14.73 J1.GND1 J1.GND2 J1.GND3 J1.GND4 | C1.1 13.72,9.91 14.22,10.41 14.22,14.04 13.66,14.61 13.59,14.61 C3.1 | C1.1 Q1.1 | C3.1 13.29,15.83 C2.1 13.29,17.95 10.41,20.83 U1.1 10.54,23.88 11.43,23.88 11.94,23.37 11.94,22.1 12.7,21.34 C5.1 14.81,21.34 C4.1 v16.26,21.72 v16.26,20.45 15.37,20.45 14.73,19.81 C6.1 | C1.1 11.37,9.91 10.41,8.95 J1.CDN2 | USB1.S6 4.4,32.54 4.4,31.16 v4.45,31.11 | J1.CDN2 J1.CDN1 J1.CDN3 | J1.CDN2 J1.CDN4
  Bottom 0.254: v16.26,20.45 2.69,20.45 SW1.2
  Bottom 0.305: J7.4 43.18,26.67 40.87,26.67 36.96,30.58 v35.18,30.58 35.18,31.09 35.15,31.12 35.15,31.88 35.8,32.52 35.8,36.56 35.36,37.01 v35.36,37.52 37.88,40.04 38.14,40.04 41.15,43.05 v41.15,43.69
  Bottom 0.381: v18.8,14.48 18.8,13.29 23.3,8.78 23.3,7.99 21.59,6.27 J2.7 J2.6 | J4.7 5.08,48.47 J6.4 12.65,40.89 18.75,40.89 J8.4 | v16.26,21.72 16.57,22.04 16.57,22.87 18.59,24.89 19.56,24.89 20.57,23.88 22.61,23.88 v23.88,25.15
  Bottom 0.508: J6.4 6.6,41.45 v6.6,39.5 6.6,33.27 v4.45,31.11 3.43,30.1 3.43,27.05 5.08,25.4 5.08,22.61 5.97,21.72 v16.26,21.72
GPIO0  (via drill 0.61)
  Top 0.254: R11.1 30.99,5.59 | 30.99,5.59 R10.1 30.43,5.63 29.97,6.1 29.97,7.17 U3.18 | 30.99,5.59 v30.99,4.57
GPIO2
  Top 0.254: D3.- 3.05,22.89 3.51,22.43 3.51,20.48 2.78,19.75 1.85,19.75 1.66,19.56 1.66,17.14 1.97,16.82 2.78,16.82 3.38,16.22 3.38,15.36 2.78,14.75 1.93,14.75 1.66,14.48 1.66,6.43 1.99,6.1 4.27,6.1 6.05,4.32 14.24,4.32 14.62,4.7 15.35,4.7 16.31,3.75 19.55,3.75 20.38,2.91 20.38,2.04 21.09,1.33 24.63,1.33 27.5,4.2 27.5,5.57 R14.1 27.77,5.88 27.77,5.92 27.9,6.05 U3.17
HSPI_CLK  (via drill 0.61)
  Top 0.381: U3.5 29.9,21.52 v25.15,16.76
HSPI_MISO  (via drill 0.61)
  Top 0.381: U3.6 27.9,21.29 v25.15,18.54
HSPI_MOSI  (via drill 0.61)
  Top 0.381: U3.7 25.9,21.07 v25.15,20.32
MISO  (via drill 0.61)
  Top 0.254: J7.1 41.91,30.59 44.77,33.45 44.77,37.16 43.07,38.86 v43.05,38.86 38.38,38.86 U4.11
MOSI  (via drill 0.61)
  Top 0.254: J7.5 43.75,27.24 43.03,27.24 42.4,26.61 41.41,26.61 40.2,25.4 39.37,25.4 38.88,24.91 38.88,5.45 38.39,4.96 34.04,4.96 33.41,5.59 R11.2 | U4.10 41.25,38 v41.4,37.85
  Bottom 0.254: J7.5 44.45,28.77 45.66,29.98 45.66,33.59 v41.4,37.85
N$1
  Top 0.254: USB1.2 5.6,36.72 5.84,36.96 8.51,36.96 8.89,37.34 D1.2 8.97,37.89 R1.1
N$2
  Top 0.254: USB1.3 5.56,36.07 5.68,36.2 8.51,36.2 8.89,35.81 D2.2 8.9,35.06 R2.1
N$3
  Top 0.254: Q2.1 8.51,28.66 8.3,28.87 R3.2
N$4  (via drill 0.61)
  Top 0.254: R7.2 25.9,6.13 U3.16
  Top 0.381: R7.2 26.09,4.86 v26.09,4.57
N$5
  Top 0.254: R21.2 1.52,30.14 D6.+
N$6
  Top 0.254: D5.- 1.95,27.35 R18.1
N$7
  Top 0.254: C16.2 U4.6
N$8
  Top 0.254: D4.- 1.95,24.81 R16.1
N$9
  Top 0.305: 5.97,37.97 F1.1
  Top 0.381: USB1.1 5.36,37.37 5.97,37.97
N$10
  Top 0.508: C3.2 C1.2 8.89,11.68 | 8.89,11.68 7.87,10.67 7.87,7.87 8.64,7.11 11.56,7.11 12.45,6.22 Q1.2 | 8.89,11.68 8.89,12.74 8.13,13.51 8.13,14.56 8.87,15.3 10.4,15.3 C2.2 8.81,20.83 7.37,20.83 5.84,22.35 U1.3
N$12
  Top 0.254: R15.1 2.58,22.39 2.58,22.43 1.65,23.37 D3.+
N$13
  Top 0.254: C18.1 R20.2
N$14
  Top 0.254: R5.2 37.9,24.9 U3.1
N$16
  Top 0.254: R12.2 21.16,38.82 Q3.1
N$17
  Top 0.254: R8.1 38.05,7.08 U3.22
N$18
  Top 0.254: R9.1 36.02,7.11 U3.21
N$21
  Top 0.254: Q4.1 17.35,37.89 R13.2
PIN_A0  (via drill 0.61)
  Top 0.254: U4.36 30.11,27.3 29.35,26.53 v29.35,26.28
  Bottom 0.254: v29.35,26.28 29.35,2.68 J3.1
PIN_A1  (via drill 0.61)
  Top 0.254: U4.37 30.91,28.12 30.62,27.83 30.62,27.09 30.37,26.84 v30.37,25.53
  Bottom 0.254: v30.37,25.53 29.86,25.02 29.86,23.11 29.86,4.43 J3.2
PIN_A2  (via drill 0.61)
  Top 0.254: U4.38 31.71,28.16 31.24,27.69 31.24,26.29 v31.51,26.02
  Bottom 0.254: J3.3 30.37,6.46 30.37,23.36 31.51,24.5 v31.51,26.02
PIN_A3  (via drill 0.61)
  Top 0.254: U4.39 32.51,28.19 32.22,27.9 v32.22,27.34
  Bottom 0.254: v32.22,27.34 32.22,26.57 32.4,26.39 32.4,25.58 32.22,25.4 32.22,24.4 30.93,23.11 30.93,8.44 J3.4
PIN_A4  (via drill 0.61)
  Top 0.254: U4.40 33.31,27.17 32.79,26.65 32.79,25.35 v33.11,25.03
  Bottom 0.254: v33.11,25.03 33.11,24.27 31.46,22.62 31.46,9.69 38.61,2.54 J3.5
PIN_A5  (via drill 0.61)
  Top 0.254: U4.41 34.11,26.63 v33.74,26.27
  Bottom 0.254: v33.74,26.27 33.74,25.65 34,25.4 34,24.16 31.97,22.12 31.97,10.71 38.61,4.06 40.39,4.06 J3.6
PIN_AREF  (via drill 0.61)
  Top 0.254: v13.72,25.53 12.7,26.54 12.7,38.35 10.4,40.65 3.75,40.65 3.74,40.64 1.27,40.64 1.15,40.76 1.15,49.41 J4.8 | U4.42 34.91,28.08 35.05,27.94 35.05,27.09 v35,27.04 35,26.19 C15.1 | v27.43,14.86 27.94,14.35 v32.85,14.35
  Bottom 0.254: v35,27.04 35,24.33 33.53,22.86 33.53,15.02 v32.85,14.35 | v27.43,14.86 26.92,15.37 26.92,25.15 25.53,26.54 22.87,26.54 21.92,25.59 20.89,25.59 20.42,26.07 14.26,26.07 v13.72,25.53
PIN_D0  (via drill 0.61)
  Top 0.254: U4.20 30.11,42.02 v29.84,42.29 | R8.2 37.13,5.87 36.92,6.08 36.92,9.61 37.21,9.91 v37.21,21.08
  Bottom 0.254: J5.1 38.86,47.75 30.96,47.75 29.72,46.51 29.72,42.42 v29.84,42.29 29.84,41.78 31.5,40.13 32.09,40.13 33.2,39.02 33.2,29.9 33.41,29.69 35.95,29.69 37.47,28.18 37.47,21.93 37.21,21.68 v37.21,21.08
PIN_D1  (via drill 0.61)
  Top 0.254: U4.21 29.31,41.57 28.82,42.06 v28.82,43.06 | R9.2 35.1,5.9 34.92,6.08 34.92,8.75 36.7,10.54 36.7,18.16 v36.32,18.54
  Bottom 0.254: J5.2 36.83,48.26 30.75,48.26 28.82,46.33 v28.82,43.06 28.82,42.06 31.25,39.62 31.88,39.62 32.64,38.86 32.64,29.75 33.2,29.18 35.74,29.18 36.96,27.97 36.96,22.14 36.32,21.51 v36.32,18.54
PIN_D2  (via drill 0.61)
  Top 0.254: U4.19 30.91,39.8 30.55,39.44 v30.55,39.06 | U3.20 33.9,8.75 35.81,10.67 v35.81,17.27 | v26.54,48.41 25.51,47.38 v18.67,47.38 | v14.35,47.37 8.53,47.37 J6.2
  Bottom 0.254: J5.3 34.8,48.77 30.54,48.77 29.4,47.63 28.32,47.63 | v35.81,17.27 35.43,17.65 35.43,21.34 36.45,22.35 36.45,27.69 35.46,28.68 32.99,28.68 32.13,29.54 32.13,38.48 31.55,39.06 v30.55,39.06 30.55,39.61 28.31,41.85 28.31,42.31 27.93,42.69 27.93,43.43 28.31,43.81 28.31,47.62 28.32,47.63 | v26.54,48.41 27.32,47.64 27.98,47.64 27.99,47.63 28.32,47.63 | v18.67,47.38 v14.36,47.38 v14.35,47.37
PIN_D3  (via drill 0.61)
  Top 0.254: U4.18 31.71,38.44 v31.24,37.97 | U3.19 31.9,8.02 34.92,11.05 v34.92,16.26 | v25.02,48.9 24.77,48.65 v18.68,48.65 | v14.35,48.64 7.79,48.64 J6.1
  Bottom 0.254: J5.4 32.77,49.28 30.14,49.28 29.01,48.14 28.2,48.14 26.94,49.4 25.53,49.4 v25.02,48.9 25.65,48.26 25.65,48.05 26.18,47.52 26.37,47.52 27.05,46.85 27.05,46.11 26.41,45.48 26.41,43.03 29.66,39.78 29.66,38.69 30.18,38.17 31.05,38.17 v31.24,37.97 31.62,37.59 31.62,29.33 32.78,28.17 35.2,28.17 35.94,27.43 35.94,22.86 34.92,21.84 v34.92,16.26 | v18.68,48.65 v14.36,48.65 v14.35,48.64
PIN_D4
  Top 0.254: J5.5 31.75,48.01 31.5,47.75 30.99,47.75 27.93,44.7 27.93,42.69 27.94,42.69 27.94,42.16 25.65,39.88 25.15,39.88 24.77,39.5 24.77,37.81 25.38,37.2 U4.25
PIN_D5  (via drill 0.61)
  Top 0.254: U4.31 25.16,32.4 25.01,32.24 24.27,32.24 23.75,32.76 23.75,34.8 | J5.6 28.96,50.8 27.68,49.52 27.68,48.66 28.64,47.7 28.64,46.85 26.91,45.12 26.91,42.67 25.14,40.89 24.73,40.89 23.75,39.92 23.75,34.8 | R12.1 v22.23,34.8 23.75,34.8
PIN_D6  (via drill 0.61)
  Top 0.254: U4.27 26.54,35.77 25.8,35.77 24.26,37.31 24.26,39.71 24.94,40.39 25.4,40.39 27.43,42.42 27.43,42.47 27.42,42.48 27.42,44.91 29.72,47.2 29.72,47.88 v28.57,49.03
  Bottom 0.254: J5.7 28.44,49.03 v28.57,49.03
PIN_D7  (via drill 0.61)
  Top 0.254: v28.41,31.75 29.01,31.75 30.91,33.66 35.49,33.66 36.96,32.19 36.96,31.41 37.57,30.8 U4.1
  Bottom 0.254: J5.8 24.13,48.51 25.27,47.38 25.27,41.1 28.48,37.89 28.89,37.89 30.33,36.45 30.33,33.16 29.3,32.13 28.79,32.13 v28.41,31.75
PIN_D8  (via drill 0.61)
  Top 0.254: v24.64,35.67 25.52,34.8 U4.28
  Bottom 0.254: v24.64,35.67 24.13,36.18 24.13,45.46 20.32,49.28 J4.1
PIN_D9  (via drill 0.61)
  Top 0.254: J8.2 17.78,44.47 J4.2 | U4.29 25.55,34 25.15,34.4 v24.64,34.4
  Bottom 0.254: J4.2 23.59,44.99 23.59,35.46 24.64,34.41 v24.64,34.4
PIN_D10  (via drill 0.61)
  Top 0.254: J8.1 15.24,45.01 J4.3 | v24.64,33.13 26.65,33.13 U4.30
  Bottom 0.254: v24.64,33.13 23.09,34.69 23.09,44.62 21.97,45.74 17.62,45.74 16.08,44.2 J8.1
PIN_D11  (via drill 0.61)
  Top 0.254: J4.4 13.91,52.01 37.33,52.01 38.04,51.3 38.04,50.35 v40.39,48.01 | U4.12 37.4,41.49 v37.43,41.47
  Bottom 0.254: v40.39,48.01 39.16,46.78 38.75,46.78 37.43,45.46 v37.43,41.47
PIN_D12  (via drill 0.61)
  Top 0.254: U4.26 27.76,36.4 v28.36,37
  Bottom 0.254: v28.36,37 24.64,40.72 24.64,47.2 22.04,49.8 22.04,51.53 21.56,52.01 12.2,52.01 10.99,50.8 J4.5
PIN_D13  (via drill 0.61)
  Top 0.254: R16.2 v3.94,24.64 3.94,26.16 4.35,26.57 v6.36,26.57 | v21.22,26.54 25.58,30.9 25.58,31.21 25.97,31.6 U4.32 | v12.95,41.91 14.99,39.88 17.27,39.88 17.91,39.24 R13.1
  Bottom 0.254: v3.94,24.64 3.94,25.41 2.54,26.81 2.54,31.72 3.43,32.61 4.78,32.61 5.64,33.46 5.64,39.05 1.81,42.88 1.81,48.03 3.87,50.1 3.87,51.3 4.58,52.01 5.58,52.01 6.79,50.8 J4.6 12.95,45.47 v12.95,41.91 | v6.36,26.57 21.19,26.57 v21.22,26.54
RESET  (via drill 0.61)
  Top 0.254: R19.1 37.08,45 C17.1 R20.1 40.13,44.07 D7.+ | v33.02,11.94 v28.45,11.94 | D7.+ 38.42,42.35 36.26,42.35 35.71,41.81 U4.13 | D7.+ 40.01,43.43 45.66,37.78 45.66,27.19 45.08,26.61 43.7,26.61 42.49,25.4 J7.3 | v27.43,25.91 28.7,24.64 31.5,24.64 31.9,24.24 U3.4
  Bottom 0.254: J2.3 12.82,1.15 25.91,1.15 26.92,2.16 26.92,10.41 v28.45,11.94 28.78,12.27 28.78,15.13 27.62,16.29 27.62,21.56 27.94,21.88 27.94,25.4 v27.43,25.91 | v33.02,11.94 38.1,11.94 38.61,12.45 38.61,24.64 39.37,25.4 J7.3
RSTAT  (via drill 0.61)
  Top 0.254: R17.2 38.05,45.97 C17.2 39.08,45.93 v39.12,45.89 | v16,12.95 19.07,12.95 v19.82,13.71 | v19.05,23.88 20.07,23.88 26.71,30.52 U4.33 28.77,30.8 30.36,32.38 34.15,32.38 34.15,32.4 v34.52,32.77
  Bottom 0.254: SW1.1 13.17,15.79 v16,12.95 | v19.82,13.71 19.82,23.11 v19.05,23.88 | v34.52,32.77 34.52,37.1 34.47,37.15 34.47,37.88 37.16,40.58 37.8,40.58 39.12,41.9 v39.12,45.89
SCK  (via drill 0.61)
  Top 0.254: J7.2 41.91,28.29 40.58,29.62 40.58,31.84 40.86,32.13 42.73,32.13 44.26,33.66 44.26,36.49 v43.76,36.98 39.57,36.98 39.36,37.2 U4.9
STANDBY1  (via drill 0.61)
  Top 0.254: Q3.3 v20.07,34.8
STANDBY2  (via drill 0.61)
  Top 0.254: Q4.3 v15.75,34.8
UGND  (via drill 0.61)
  Top 0.254: v28.44,35.18 36.13,35.18 37.31,34 U4.5 39.64,34 39.92,33.72 41.21,33.72 C16.1 | v9.91,31.5 6.86,31.5 L1.2
  Top 0.305: USB1.5 4.98,34.77 5.71,34.04 5.71,33.4 6.6,32.51 L1.2
  Bottom 0.254: v28.44,35.18 28.44,34.96 22.06,28.57 12.32,28.57 9.91,30.99 v9.91,31.5
VIN
  Top 0.508: 14.86,6.22 13.72,5.08 11.43,5.08 10.99,5.52 J1.VCC1 J1.VCC2 J1.VCC4 J1.VCC3 | 14.86,6.22 Q1.3 | J2.8 21.59,5.08 16,5.08 14.86,6.22
VUSB  (via drill 0.61)
  Top 0.254: v29.34,36.18 29.8,35.73 36.91,35.73 37.04,35.6 U4.7 39.64,35.6 39.92,35.88 42.88,35.88 43.18,35.58 43.18,34.02 42.37,33.21 40.14,33.21 39.44,32.51 39.44,31.82 39.22,31.6 U4.2
  Top 0.381: F1.2 7.89,34.02 7.89,32.9 8.34,32.45 10.3,32.45 10.86,31.89 10.86,31.3 v11.18,30.99 10.54,30.35 Q2.3
  Bottom 0.254: v29.34,36.18 28.8,36.18 28.69,36.07 28.07,36.07 27.55,35.55 27.55,34.79 21.85,29.08 12.53,29.08 11.18,30.44 v11.18,30.99
XTAL1
  Top 0.254: U4.17 32.51,41.7 R4.2 31.62,42.6 X1.P$1 30.59,44.05 30.59,45.55 31.03,46 C9.2
XTAL2
  Top 0.254: C10.2 34.5,45.45 X1.P$3 32.88,43.84 32.88,42.33 33.23,41.99 R4.1 33.31,41.83 U4.16

### Text on the board
_tNames: J5 | J5 | J4 | J4 | C10 | C10 | R17 | R17 | X1 | X1 | C8 | C8 | C19 | C19 | R18 | R18 | I2C | I2C | DIO1 | DIO1 | R5 | R5 | R19 | R19 | C20 | C20 | D7 | D7 | C5 | C5 | USB1 | USB1 | F1 | F1 | D2 | D2 | R1 | R1 | C4 | C4 | D3 | D3 | R2 | R2 | D4 | D4 | C9 | C9 | R12 | R12 | R3 | R3 | L1 | L1 | Q2 | Q2 | R9 | R9 | D5 | D5 | C6 | C6 | U1 | U1 | C7 | C7 | C3 | C3 | R8 | R8 | R13 | R13 | D6 | D6 | U2 | U2 | ICSP | ICSP | R10 | R10 | U3 | U3 | D1 | D1 | R4 | R4 | C12 | C12 | C13 | C13 | C16 | C16 | C11 | C11 | U4 | U4 | RESET_SW | RESET_SW | J1 | J1 | C15 | C15 | C14 | C14 | Q1 | Q1 | R7 | R7 | R14 | R14 | R15 | R15 | C17 | C17 | C18 | C18 | R6 | R6 | R16 | R16 | R11 | R11 | J3 | J3 | J2 | J2
_tFinish: J5 | J5 | J4 | J4 | C10 | C10 | C8 | C8 | J1 | J1 | J3 | J3 | J2 | J2
silktop: ARF | GND | ~13 | 12 | ~11 | ~10 | ~9 | 8 | 7 | ~6 | ~5 | 4 | ~3 | 2 | TX1 | RX0 | PWR ACT D13 ESP | Adelino X1 / NEOautus | 5V | RST | 33 | 5V | -GND- | VIN | A0 | A1 | A2 | A3 | A4 | A5
silkbottom: Adelino X1 / www.neoautus.com / Prototype only